# Altium schematic sheet MOD.SchDoc: Modification Information
size B; DrawnBy: DJW; DocumentNumber: 17; SheetNumber: 17; SheetTotal: 17
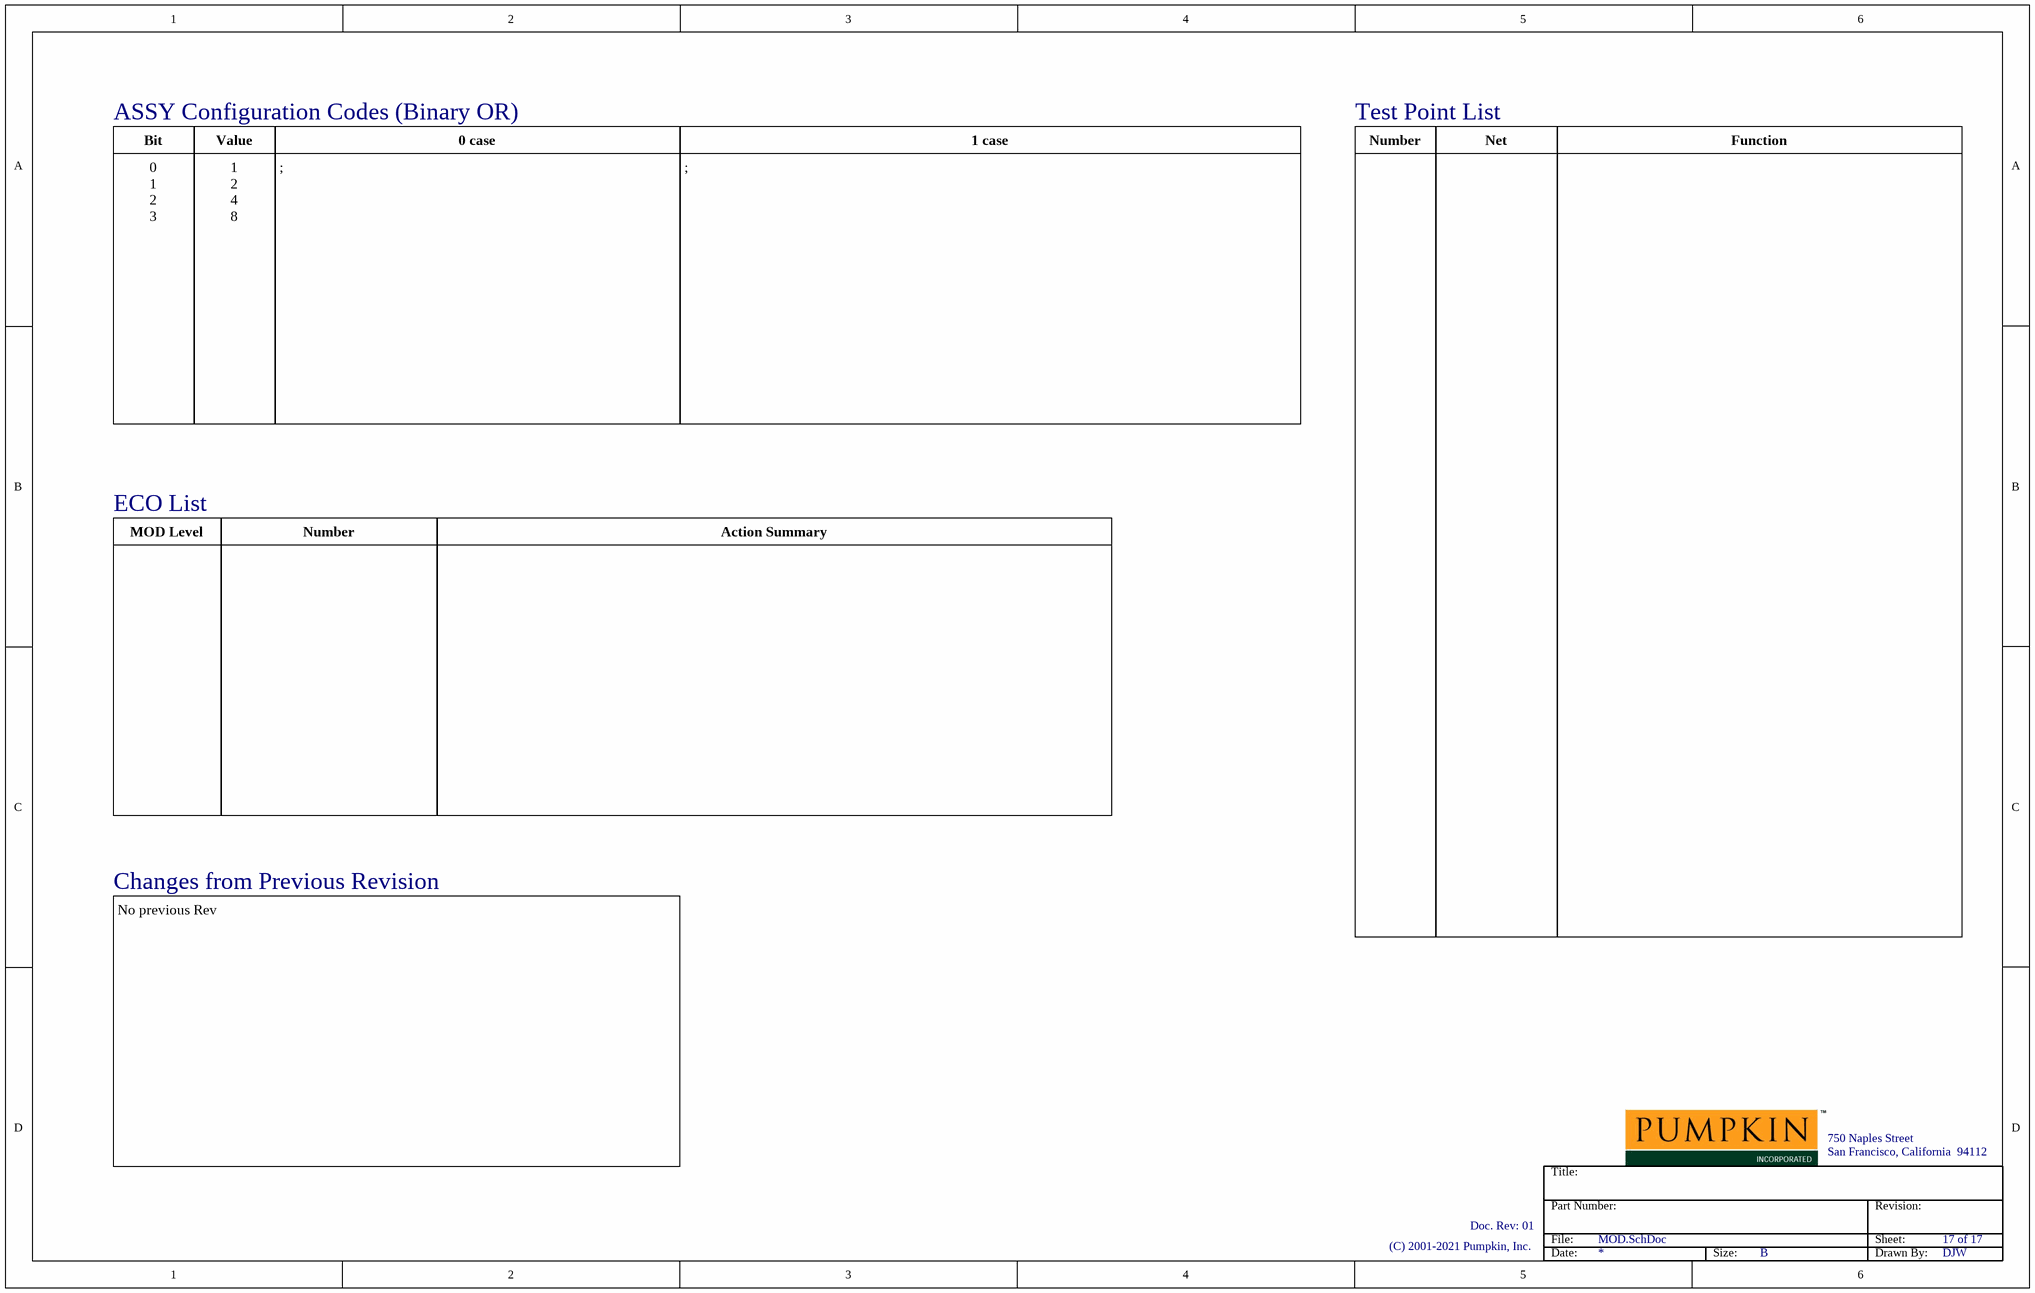
[diagram p0: MOD.SchDoc]

## Notes on the sheet
- ASSY Configuration Codes (Binary OR)
- Bit
- Value
- 0 case
- 1 case
- Test Point List
- Number
- Net
- Function
- 0
  1
  2
  3
- 1
  2
  4
  8
- ;
- ECO List
- MOD Level
- Action Summary
- Changes from Previous Revision
- No previous Rev
- Title:
- 750 Naples Street
- San Francisco, California  94112
- Doc. Rev: 01
- File:
- Part Number:
- Revision:
- Sheet:
- (C) 2001-2021 Pumpkin, Inc.
- Date:
- Size:
- B
- Drawn By: